# EAGLE design PocaSynth (EAGLE 9.6.2)
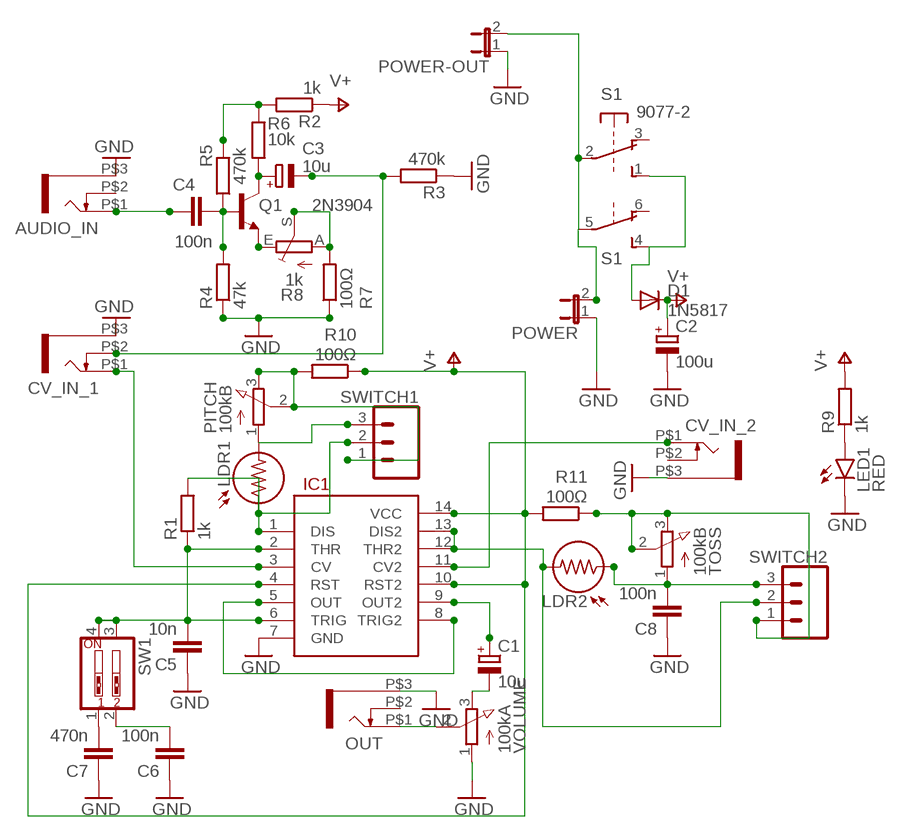
[diagram p0: schematic, sheet 1]

## Parts
AUDIO_IN  WQP-PJ301M-12_JACK  [WQP-PJ301M-12_JACK]
C1  10u  CPOL-EUE2.5-7  [E2,5-7]
C2  100u  CPOL-EUE2.5-7  [E2,5-7]
C3  10u  CPOL-EUE2.5-7  [E2,5-7]
C4  100n  C-EU050-035X075  [C050-035X075]
C5  10n  C-EU050-030X075  [C050-030X075]
C6  100n  C-EU050-030X075  [C050-030X075]
C7  470n  C-EU050-035X075  [C050-035X075]
C8  100n  C-EU050-030X075  [C050-030X075]
CV_IN_1  WQP-PJ301M-12_JACK  [WQP-PJ301M-12_JACK]
CV_IN_2  WQP-PJ301M-12_JACK  [WQP-PJ301M-12_JACK]
D1  1N5817  1N4004  [DO41-10]
IC1  556  [DIL14]
LDR1  LDR5MM  [LDR338-54C]
LDR2  LDR5MM  [LDR338-54C]
LED1  RED  LED3MM  [LED3MM]
OUT  WQP-PJ301M-12_JACK  [WQP-PJ301M-12_JACK]
PITCH  100kB  EVUF3M  [EVUFXM]
POWER  JP1E  [JP1]
POWER-OUT  JP1E  [JP1]
Q1  2N3904  [TO92-]
R1  1k  R-EU_0207/10  [0207/10]
R2  1k  R-EU_0207/10  [0207/10]
R3  470k  R-EU_0207/10  [0207/10]
R4  47k  R-EU_0207/10  [0207/10]
R5  470k  R-EU_0207/10  [0207/10]
R6  10k  R-EU_0207/10  [0207/10]
R7  100Ω  R-EU_0207/10  [0207/10]
R8  1k  TRIM_EU-CA6V  [CA6V]
R9  1k  R-EU_0207/10  [0207/10]
R10  100Ω  R-EU_0207/10  [0207/10]
R11  100Ω  R-EU_0207/10  [0207/10]
S1  9077-2  [9077-2]
SW1  SW_DIP-2  [EDG-02]
SWITCH1  CONN_03LOCK  [1X03_LOCK]
SWITCH2  CONN_03LOCK  [1X03_LOCK]
TOSS  100kB  EVUF3M  [EVUFXM]
VOLUME  100kA  EVUF3M  [EVUFXM]

## Nets
GND: AUDIO_IN.P$3 C2.- C5.1 C6.1 C7.1 C8.1 CV_IN_1.P$3 CV_IN_2.P$3 IC1.7(GND) LED1.K(C) OUT.P$3 POWER-OUT.1 POWER.1 R3.1 R4.1 R7.1 VOLUME.1(A)
N$1: C5.2 IC1.2(THR) IC1.6(TRIG) R1.1 SW1.3 SW1.4
N$2: IC1.1(DIS) LDR1.1 R1.2 SWITCH1.2
N$3: C6.2 SW1.2
N$4: IC1.5(OUT) IC1.8(TRIG2)
N$5: IC1.12(THR2) IC1.13(DIS2) LDR2.2 SWITCH2.2
N$6: OUT.P$1 VOLUME.2(S)
N$7: POWER-OUT.2 POWER.2 S1.2(1:P) S1.5(2:P)
N$8: CV_IN_1.P$1 IC1.3(CV)
N$9: AUDIO_IN.P$1 C4.1
N$10: C1.+ IC1.9(OUT2)
N$11: C1.- VOLUME.3(E)
N$12: C7.2 SW1.1
N$13: C4.2 Q1.2(B) R4.2 R5.1
N$14: C3.+ Q1.1(C) R6.1
N$15: Q1.3(E) R8.E
N$16: PITCH.2(S) PITCH.3(E) R10.2 SWITCH1.1
N$17: R7.2 R8.A R8.S
N$18: C3.- CV_IN_1.P$2 R3.2
N$19: CV_IN_2.P$1 IC1.11(CV2)
N$20: R11.1 SWITCH2.1 TOSS.2(S) TOSS.3(E)
N$21: LDR1.2 PITCH.1(A) SWITCH1.3
N$22: C8.2 LDR2.1 SWITCH2.3 TOSS.1(A)
N$23: R2.2 R5.2 R6.2
N$24: LED1.A R9.1
N$26: D1.A S1.1(1:S) S1.4(2:S)
V+: C2.+ D1.C IC1.4(RST) IC1.10(RST2) IC1.14(VCC) R2.1 R9.2 R10.1 R11.2
Unconnected: AUDIO_IN.P$2 CV_IN_2.P$2 OUT.P$2 S1.3(1:O) S1.6(2:O)

## Library data of the parts
AUDIO_IN CV_IN_1 CV_IN_2 OUT = thonkiconn:WQP-PJ301M-12_JACK
C1-C3 = rcl:CPOL-EU: POLARIZED CAPACITOR, European symbol
C4-C8 = rcl:C-EU: CAPACITOR, European symbol
D1 = diode:1N4004: DIODE general purpose rectifier, 1 A
IC1 = SparkFun-AnalogIC:556: Dual timer circuit (2 555 timers in one package)
LDR1 LDR2 = gm-resistors:LDR
LED1 = gm-diodes:LED
PITCH TOSS VOLUME = AFA-TUTCOMP:EVU: 9 mm Square Rotary Potentiometers Source: Panasonic
POWER POWER-OUT = jumper:JP1E: JUMPER
Q1 = gm-trans:2N3904: NPN Transistor
R1-R7 R9-R11 = rcl:R-EU_: RESISTOR, European symbol
R8 = pot:TRIM_EU-: POTENTIOMETER
S1 = switch-misc:9077-2: MARQUARDT SWITCH 9077.0200 Distributor: Buerklin <https://www.buerklin.com/default.asp?event=ShowArtikel%2812G2822%29&l=d&jump=ArtNr_12G2822>
SW1 = special:SW_DIP-2: DIP SWITCH
SWITCH1 SWITCH2 = SparkFun-Connectors:CONN_03: Multi connection point. Often used as Generic Header-pin footprint for 0.1 inch spaced/style header connections On any of the 0.1 inch spaced packages, you can populate with these: Break Away Headers - Straight <https://www.sparkfun.com/products/116> (PRT-00116) Break Away Male Headers - Right Angle <https://www.sparkfun.com/products/553> (PRT-00553) Female Headers <https://www.sparkfun.com/products/115> (PRT-00115) Break Away Headers - Machine Pin <https://www.sparkfun.com/products/117> (PRT-00117) Break Away Female Headers - Swiss Machine Pin <https://www.sparkfun.com/products/743> (PRT-00743) Stackable Header - 3 Pin (Female, 0.1") <https://www.sparkfun.com/products/13875> (PRT-13875) For SCREWTERMINALS and SPRING TERMINALS visit here: Screw Terimnals on SparkFun.com <https://www.sparkfun.com/search/results?term=Screw+Terminals> (5mm/3.5mm/2.54mm spacing) This device is also useful as a general connection point to wire up your design to another part of your project. Our various solder wires solder well into these plated through hole pads. Hook-Up Wire - Assortment (Stranded, 22 AWG) <https://www.sparkfun.com/products/11375> (PRT-11375) Hook-Up Wire - Assortment (Solid Core, 22 AWG) <https://www.sparkfun.com/products/11367> (PRT-11367) View the entire wire category on our website here <https://www.sparkfun.com/categories/141> Special notes: Molex polarized connector foot print use with SKU : PRT-08232 with associated crimp pins and housings.

## Board
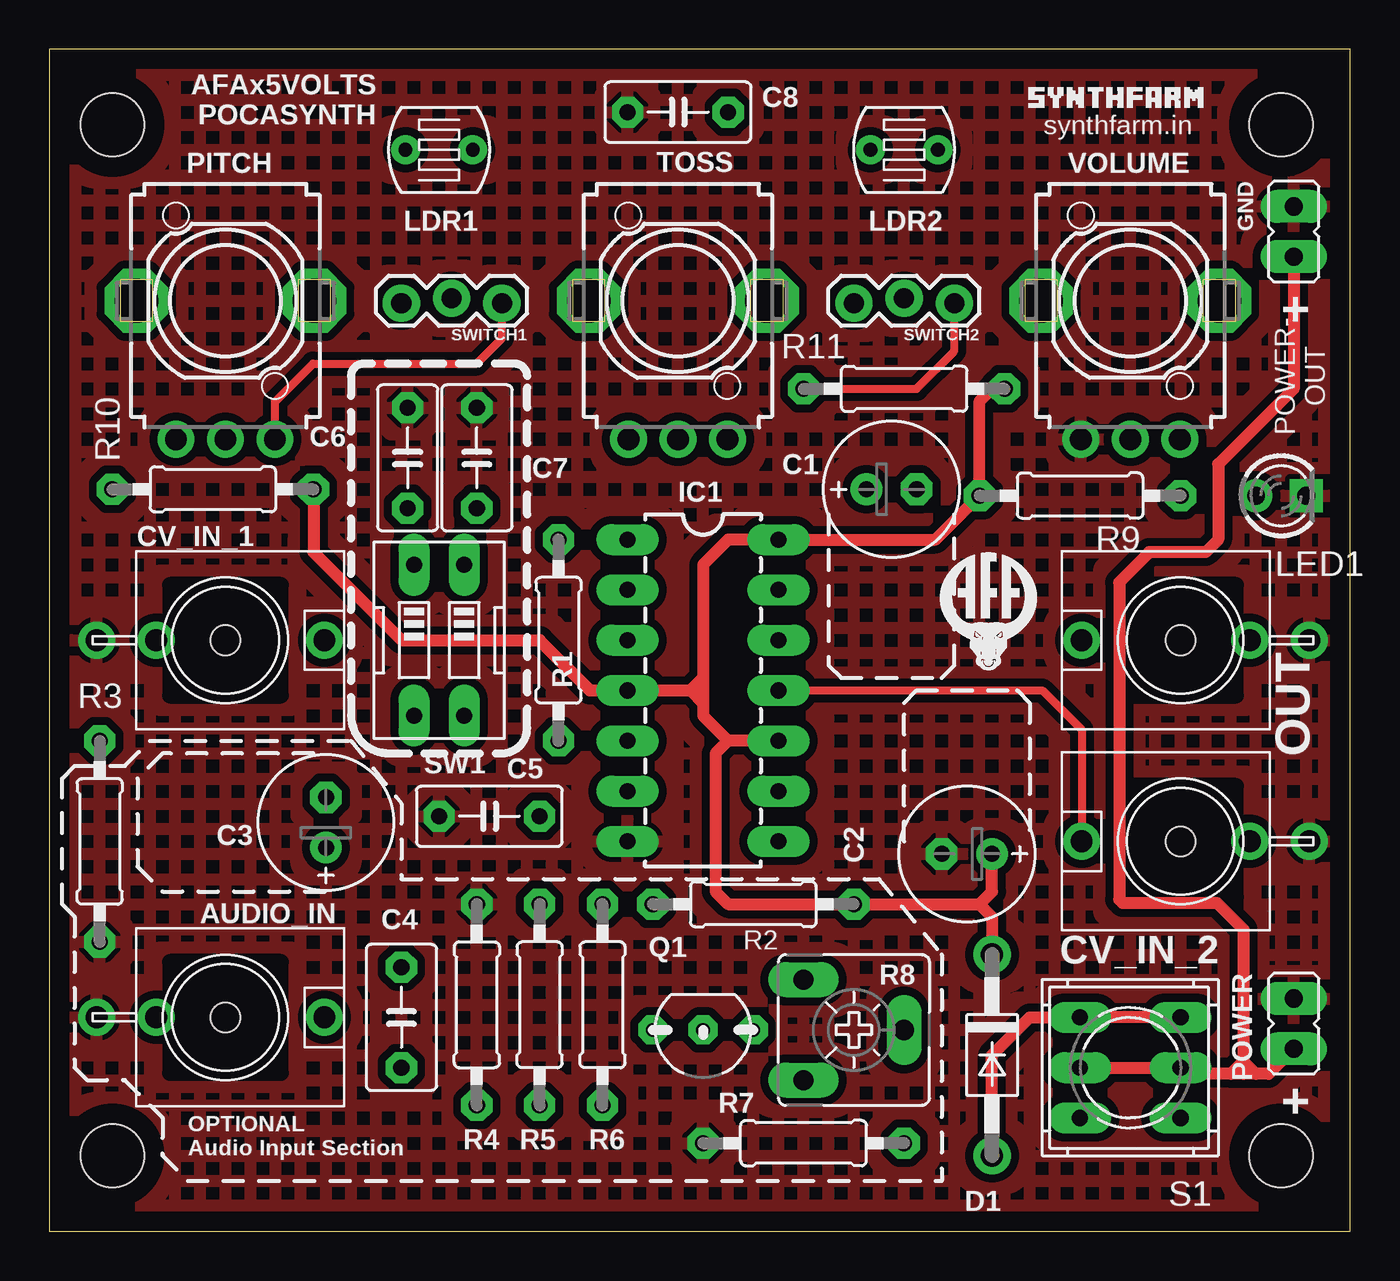
[diagram p1: board, top side]
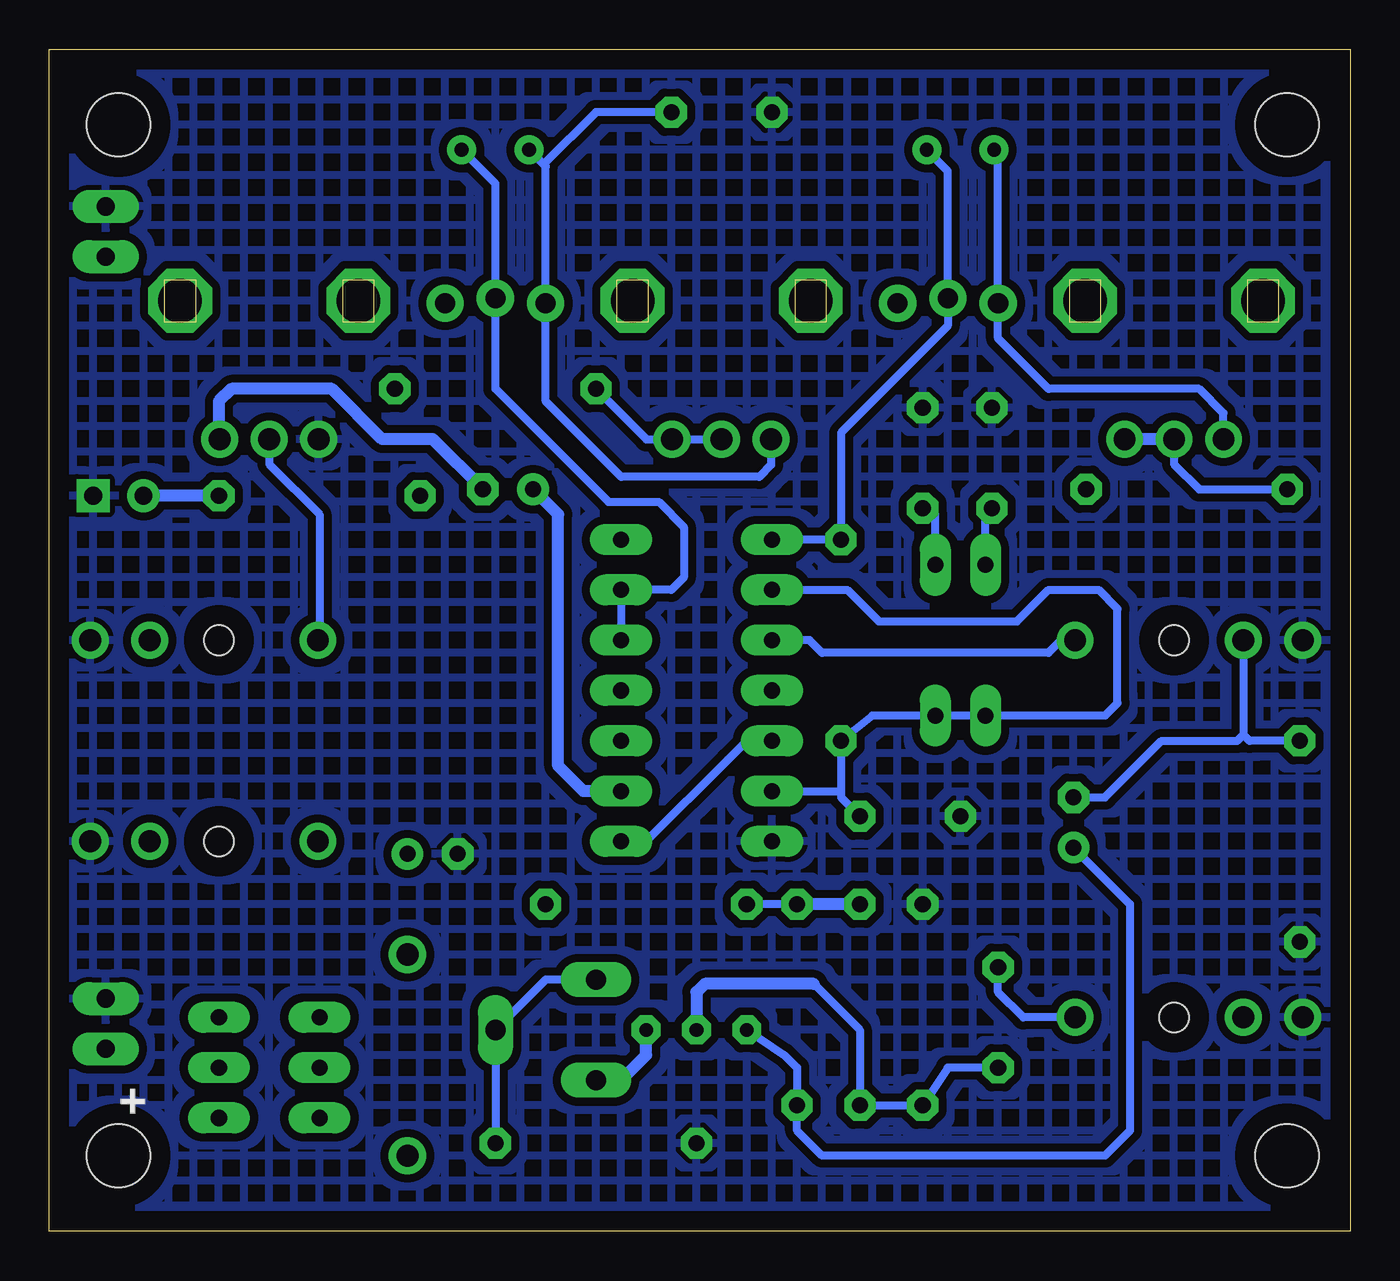
[diagram p2: board, bottom side, seen from below]

Size 65.71 x 59.68 mm. Coordinates in mm from the lower left corner, seen from the top.
Outline: 0,0 65.71,0 65.71,59.68 0,59.68 0,0
Copper layers (1*16): Top 0.035mm / dielectric 1.5mm / Bottom 0.035mm
Design rules "default *": minimum track width 10mil, minimum drill 24mil, track to track 8mil, track to pad 8mil, pad to pad 8mil, via to via 8mil, smd to smd 8mil, copper to edge 40mil, drill to drill 8mil, minimum pad ring 15mil, minimum via ring 8mil, stop-mask expansion 4mil, vias tented up to drill 0mil, thermal gap 10mil
Holes 3.2 mm at 3.17,55.88 3.17,3.81 62.23,55.88 62.23,3.81
Holes 1.5 mm at 8.89,29.84 8.89,10.79 57.15,19.68 57.15,29.84

### Footprints (pad centres in the part's own frame; a part is rotated, then mirrored left to right if it is on the bottom)
WQP-PJ301M-12_JACK = drill 1.1: P$1 0,5; P$2 0,-3.5; P$3 0,-6.5
E2,5-7 = drill 0.813 pad 1.6: + -1.27,0 | drill 0.813 pad 1.6 octagon: - 1.27,0
C050-035X075 = drill 0.813 octagon: 1 -2.54,0; 2 2.54,0
C050-030X075 = drill 0.813 octagon: 1 -2.54,0; 2 2.54,0
DO41-10 = drill 1.118: A 5.08,0; C -5.08,0
DIL14 = drill 0.813 long: 1 -8.89,-3.81; 2 -6.35,-3.81; 3 -3.81,-3.81; 4 -1.27,-3.81; 5 1.27,-3.81; 6 3.81,-3.81; 7 6.35,-3.81; 8 6.35,3.81; 9 3.81,3.81; 10 1.27,3.81; 11 -1.27,3.81; 12 -3.81,3.81; 13 -6.35,3.81; 14 -8.89,3.81
LDR338-54C = drill 0.7: 1 0,1.702; 2 0,-1.702
LED3MM = drill 0.9: A -1.27,0 | drill 0.9 square: K 1.27,0
EVUFXM = drill 1.1 pad 1.676: 1 -2.5,-7; 2 0,-7; 3 2.5,-7 | drill 2.2 pad 3.2 octagon: M1 4.5,0; M2 -4.5,0
JP1 = drill 0.914 long: 1 0,-1.27; 2 0,1.27
TO92- = drill 0.7 octagon: 1 2.54,0; 2 0,0; 3 -2.54,0
0207/10 = drill 0.813 octagon: 1 -5.08,0; 2 5.08,0
CA6V = drill 1.016 long: A -2.54,-2.54; E 2.54,-2.54; S 0,2.54
9077-2 = drill 0.813 long: 1 -2.54,2.54; 2 0,2.54; 3 2.54,2.54; 4 -2.54,-2.54; 5 0,-2.54; 6 2.54,-2.54
EDG-02 = drill 0.813 long: 1 -1.27,-3.81; 2 1.27,-3.81; 3 1.27,3.81; 4 -1.27,3.81
1X03_LOCK = drill 1.016 pad 1.88: 1 0,0.127; 2 2.54,-0.127; 3 5.08,0.127

### Placement (x,y rotation side)
AUDIO_IN  8.89,10.79 270 top
C1  42.55,37.47 0 top
C2  46.35,19.05 180 top
C3  13.97,20.64 90 top
C4  17.78,10.79 270 top
C5  22.23,20.95 0 top
C6  18.1,39.05 270 top
C7  21.59,39.05 270 top
C8  31.75,56.52 0 top
CV_IN_1  8.89,29.84 270 top
CV_IN_2  57.15,19.68 90 top
D1  47.62,8.89 270 top
IC1  33.02,26.04 270 top
LDR1  19.68,54.61 270 top
LDR2  43.18,54.61 90 top
LED1  62.23,37.15 0 top
OUT  57.15,29.84 90 top
PITCH  8.89,46.99 0 top
POWER  62.87,10.48 180 top
POWER-OUT  62.87,50.48 180 top
Q1  33.02,10.16 180 top
R1  25.72,29.84 90 top
R2  35.56,16.51 180 top
R3  2.54,19.68 90 top
R4  21.59,11.43 270 top
R5  24.77,11.43 90 top
R6  27.94,11.43 90 top
R7  38.1,4.45 0 top
R8  40.64,10.16 270 top
R9  52.07,37.15 180 top
R10  8.26,37.47 180 top
R11  43.18,42.55 0 top
S1  54.61,8.26 270 top
SW1  19.68,29.84 180 top
SWITCH1  22.86,46.99 180 top
SWITCH2  45.72,46.99 180 top
TOSS  31.75,46.99 0 top
VOLUME  54.61,46.99 0 top

### Tracks (layer width: path | path; a pad name or v marks a point on that pad's centre or on a via)
GND
  pour Bottom (isolate 0.406, hatched): 0,59.05 65.41,59.05 65.41,0 0,0
  pour Top (isolate 0.406, hatched): 1.91,59.05 65.41,59.05 65.41,0.64 64.77,0 1.91,0 0.64,1.27 0.64,57.78
N$1
  Bottom 0.406: IC1.2 25.4,32.38 23.81,30.8 16.83,30.8 15.24,32.38 12.7,32.38 11.75,31.43 11.75,26.67 12.38,26.04 SW1.3 SW1.4 24.13,26.04 R1.1 25.72,22.23 | 25.72,22.23 25.72,21.91 C5.2 | IC1.6 25.72,22.23
N$2
  Bottom 0.406: IC1.1 R1.2 25.72,40.32 20.32,45.72 SWITCH1.2 20.32,53.54 LDR1.1
N$3
  Bottom 0.406: SW1.2 18.41,36.2 C6.2
N$4
  Bottom 0.406: IC1.8 35.56,19.68 31.43,23.81 30.48,24.77 IC1.5
N$5
  Bottom 0.406: IC1.12 IC1.13 34.29,32.38 33.66,33.02 33.66,35.56 34.92,36.83 37.47,36.83 43.18,42.55 SWITCH2.2 43.18,52.91 LDR2.2
N$6
  Bottom 0.406: VOLUME.2 54.61,38.73 52.07,36.2 52.07,29.93 OUT.P$1
N$7
  Top 0.61: S1.5 S1.2 57.47,7.94 59.69,7.94 | POWER.2 61.59,7.94 60.96,7.94 | 60.96,7.94 60.33,7.94 | 60.33,7.94 59.69,7.94 | POWER-OUT.2 62.87,42.55 59.05,38.73 59.05,34.92 58.42,34.29 55.56,34.29 54.05,32.77 54.05,16.76 54.22,16.58 58.98,16.58 60.33,15.24 60.33,8.89 60.33,8.57 | 60.33,8.57 60.33,7.94 | 60.96,7.94 60.33,8.57 | 60.33,8.57 59.69,7.94
N$8
  Bottom 0.406: CV_IN_1.P$1 14.61,29.84 15.24,29.21 26.67,29.21 27.3,29.84 IC1.3
N$9
  Bottom 0.406: AUDIO_IN.P$1 16.51,10.79 17.78,12.06 C4.1
N$10
  Bottom 0.61: IC1.9 38.73,22.23 40.01,23.5 40.01,36.2 C1.+
N$11
  Bottom 0.61: C1.- 46.35,40.01 48.9,40.01 51.44,42.55 56.52,42.55 57.15,41.91 57.15,40.03 VOLUME.3
N$12
  Bottom 0.406: SW1.1 20.95,36.2 C7.2
N$13
  Bottom 0.406: C4.2 20.32,8.26 R4.2 R5.1 24.77,10.16 27.09,12.49
  Bottom 0.61: 27.09,12.49 32.6,12.49 33.02,12.06 Q1.2
N$14
  Bottom 0.406: Q1.1 28.57,8.89 27.94,8.26 R6.1 27.94,5.08 26.67,3.81 12.38,3.81 11.11,5.08 11.11,16.51 C3.+
N$15
  Bottom 0.61: R8.E 36.83,7.62 35.56,8.89 Q1.3
N$16
  Top 0.406: PITCH.3 11.39,41.9 13.31,43.81 21.59,43.81 22.86,45.09 SWITCH1.1
  Bottom 0.406: PITCH.2 8.89,38.73 7.62,37.47 R10.2
  Bottom 0.61: PITCH.2 PITCH.3
N$17
  Bottom 0.406: R8.A 40.64,12.7 R8.S R7.2
N$18
  Bottom 0.406: R3.2 5.08,24.77 5.39,25.07 | CV_IN_1.P$2 5.39,25.07 | C3.- 12.38,21.91 9.53,24.77 5.7,24.77 5.39,25.07
N$19
  Top 0.406: IC1.11 50.16,27.3 52.15,25.32 CV_IN_2.P$1
N$20
  Top 0.406: R11.1 43.81,42.55 45.72,44.45 SWITCH2.1
  Bottom 0.406: TOSS.2 TOSS.3 35.55,39.99 R11.1
N$21
  Bottom 0.406: PITCH.1 6.39,41.31 7.62,42.55 15.24,42.55 17.78,45.09 SWITCH1.3 17.78,54.41 LDR1.2
N$22
  Bottom 0.406: TOSS.1 29.25,38.7 29.84,38.1 36.83,38.1 40.64,41.91 SWITCH2.3 40.64,53.77 40.74,53.87 | 40.74,53.87 LDR2.1 | C8.2 38.1,56.52 40.74,53.87
N$23
  Bottom 0.406: R6.2 R2.2
  Bottom 0.61: R5.2 R6.2
N$24
  Bottom 0.61: R9.1 LED1.A
N$26
  Top 0.61: D1.A 47.62,8.89 49.53,10.79 S1.4 S1.1
V+
  Top 0.61: IC1.10 34.29,24.77 | 34.29,24.77 33.66,24.13 33.66,17.14 34.29,16.51 R2.1 46.99,16.51 | 46.99,16.51 47.62,15.88 D1.C | 33.02,27.94 33.02,33.66 34.29,34.92 IC1.14 44.77,34.92 R9.2 46.99,41.91 47.62,42.55 R11.2 | 33.02,27.94 33.02,27.3 | 33.02,27.3 33.02,26.67 | 33.02,26.67 33.02,26.04 34.29,24.77 | 32.38,27.3 IC1.4 27.3,27.3 24.77,29.84 17.78,29.84 13.34,34.29 R10.1 | 33.02,27.3 32.38,27.3 | 32.38,27.3 33.02,26.67 | 32.38,27.3 33.02,27.94 | 46.99,16.51 47.62,17.14 C2.+

### Text on the board
tPlace: AFAx5VOLTS / POCASYNTH | synthfarm.in | GND | + | + | OPTIONAL / Audio Input Section
bPlace: +
tNames: POWER- / OUT